# EAGLE design Grove - RJ45 Adapter v1.0b (EAGLE 6.3)
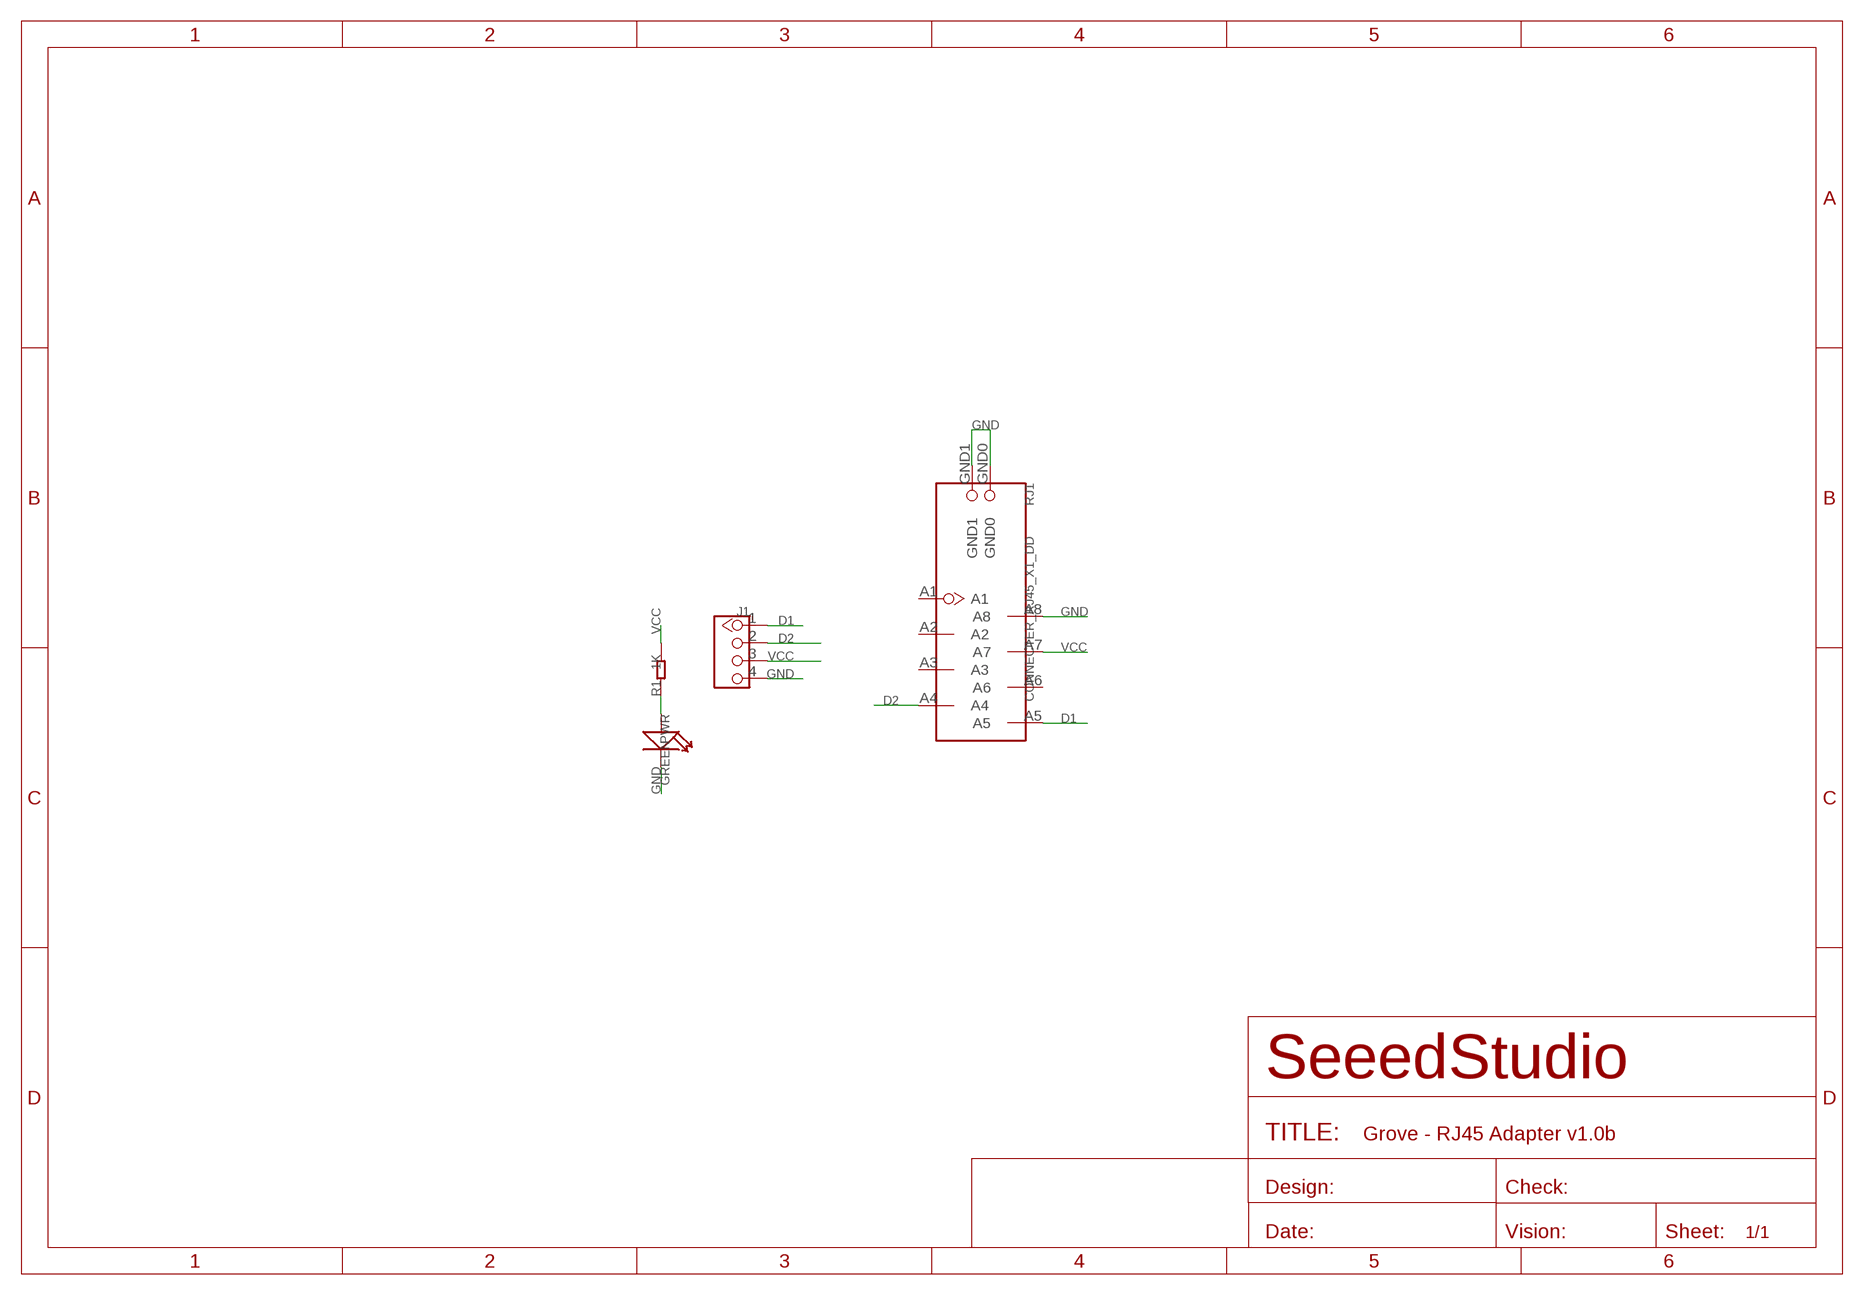
[diagram p0: schematic, sheet 1]

## Parts
J1  TWIG-4P-2.0-2.0  [4P-2.0]
PWR  GREEN  LED'0603'  [LED-0603]
R1  1K  R-0603  [R0603]
RJ1  CONNECTER_RJ45_X1_DD  [CONNECTER_RJ45_X1]

## Nets
D1: J1.1 RJ1.A5
D2: J1.2 RJ1.A4
GND: J1.4 PWR.- RJ1.A8 RJ1.GND0 RJ1.GND1
N$1: PWR.+ R1.1
VCC: J1.3 R1.2 RJ1.A7
Unconnected: RJ1.A1 RJ1.A2 RJ1.A3 RJ1.A6

## Library data of the parts
J1 = Connector:TWIG-4P-2.0
PWR = Discrete:LED*
R1 = Discrete:R*
RJ1 = template:CONNECTER_RJ45_X1

## Net classes
0 default: width 0.203 mm, drill 0.305 mm, clearance 0.152 mm

## Board
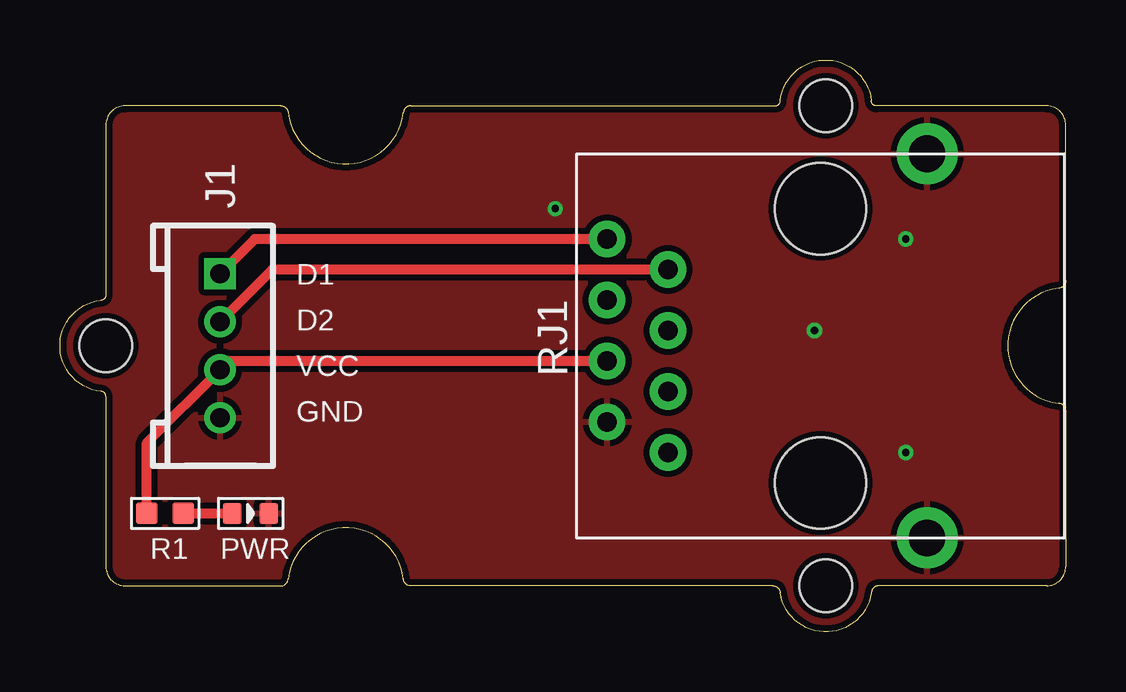
[diagram p1: board, top side]
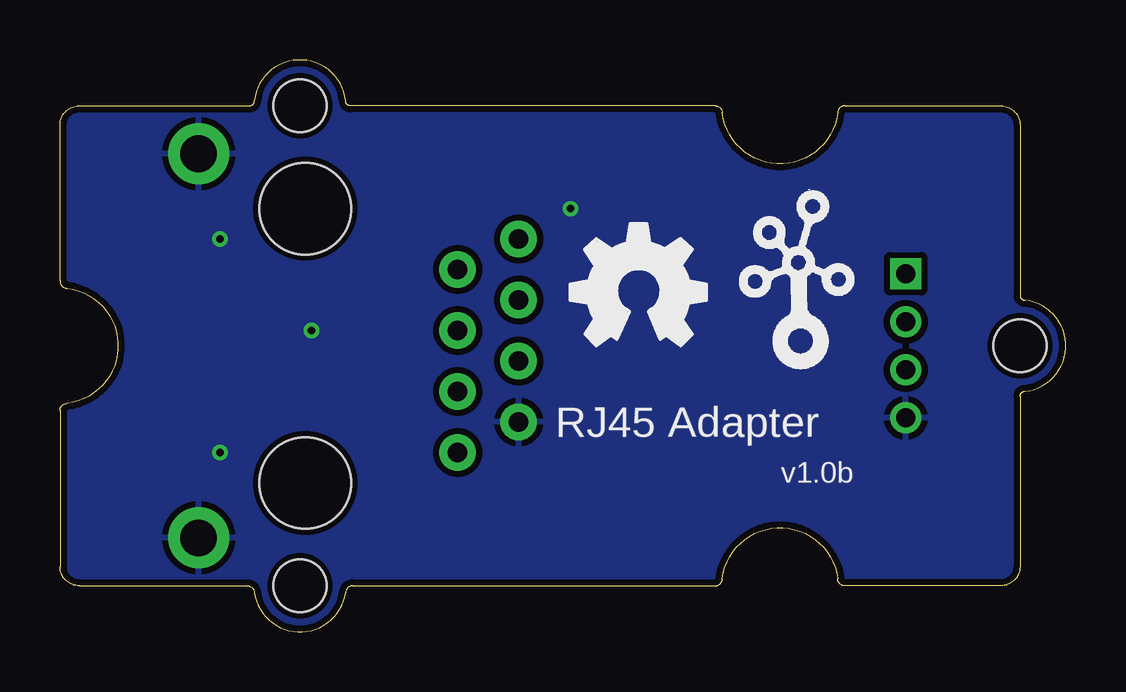
[diagram p2: board, bottom side, seen from below]

Size 41.91 x 23.83 mm. Coordinates in mm from the lower left corner, seen from the top.
Copper layers (1*16): Top 0.035mm / dielectric 1.5mm / Bottom 0.035mm
Design rules "SeeedStudio_rule_no_angle_090911 *": minimum track width 6mil, minimum drill 12mil, track to track 6mil, track to pad 6mil, pad to pad 6mil, via to via 6mil, smd to smd 0mil, copper to edge 10mil, drill to drill 10mil, minimum pad ring 10mil, minimum via ring 6mil, stop-mask expansion 2mil, vias tented up to drill 25mil, thermal gap 10mil

### Footprints (pad centres in the part's own frame; a part is rotated, then mirrored left to right if it is on the bottom)
4P-2.0 = drill 0.8 pad 1.27 square: 1 -3,0 | drill 0.8 pad 1.27: 2 -1,0; 3 1,0; 4 3,0
LED-0603 = smd 0.762 x 0.889: + -0.762,0; - 0.762,0
R0603 = smd 0.889 x 0.889: 1 -0.762,0; 2 0.762,0
CONNECTER_RJ45_X1 = drill 0.813 pad 1.524: A1 -2.54,5.08; A2 -2.54,2.54; A3 -2.54,0; A4 -2.54,-2.54; A5 0,-3.81; A6 0,-1.27; A7 0,1.27; A8 0,3.81 | drill 1.524 pad 2.54: GND0 -13.335,8.636; GND1 -13.335,-7.366 | hole 3.81: -8.89,-5.08; -8.89,6.35
2U-DIM-W/DRILL = hole 2.2: -10,-10; -10,10; 20,0

### Placement (x,y rotation side)
J1  6.67,11.92 270 top
PWR  7.94,4.94 0 top
R1  4.38,4.94 180 top
RJ1  22.8,12.56 180 top
U$1  [2U-DIM-W/DRILL]  21.91,11.92 180 top
U$2  [OSHW_FILLX200_NOTEXT]  20.64,11.92 0 bottom
U$3  [TWIGLOGO]  11.11,11.92 0 bottom

### Tracks (layer width: path | path; a pad name or v marks a point on that pad's centre or on a via)
D1
  Top 0.406: RJ1.A5 8.11,16.37 J1.1
D2
  Top 0.406: RJ1.A4 8.84,15.1 J1.2
GND  (via drill 0.3 pad 0.64)
  other vias: 20.64,17.64 35.24,16.37 35.24,7.48 31.43,12.56
  pour Bottom (isolate 0.254): -0.32,-0.14 42.23,-0.14 42.23,23.99 -0.32,23.99 -0.32,0.11
  pour Top (isolate 0.254): -0.32,-0.14 42.23,-0.14 42.23,23.99 -0.32,23.99 -0.32,0.11
N$1
  Top 0.406: R1.1 PWR.+
VCC
  Top 0.406: RJ1.A7 7.03,11.29 J1.3 3.62,7.87 R1.2

### Text on the board
tPlace: D1 | D2 | VCC | GND
bPlace: RJ45 Adapter | v1.0b